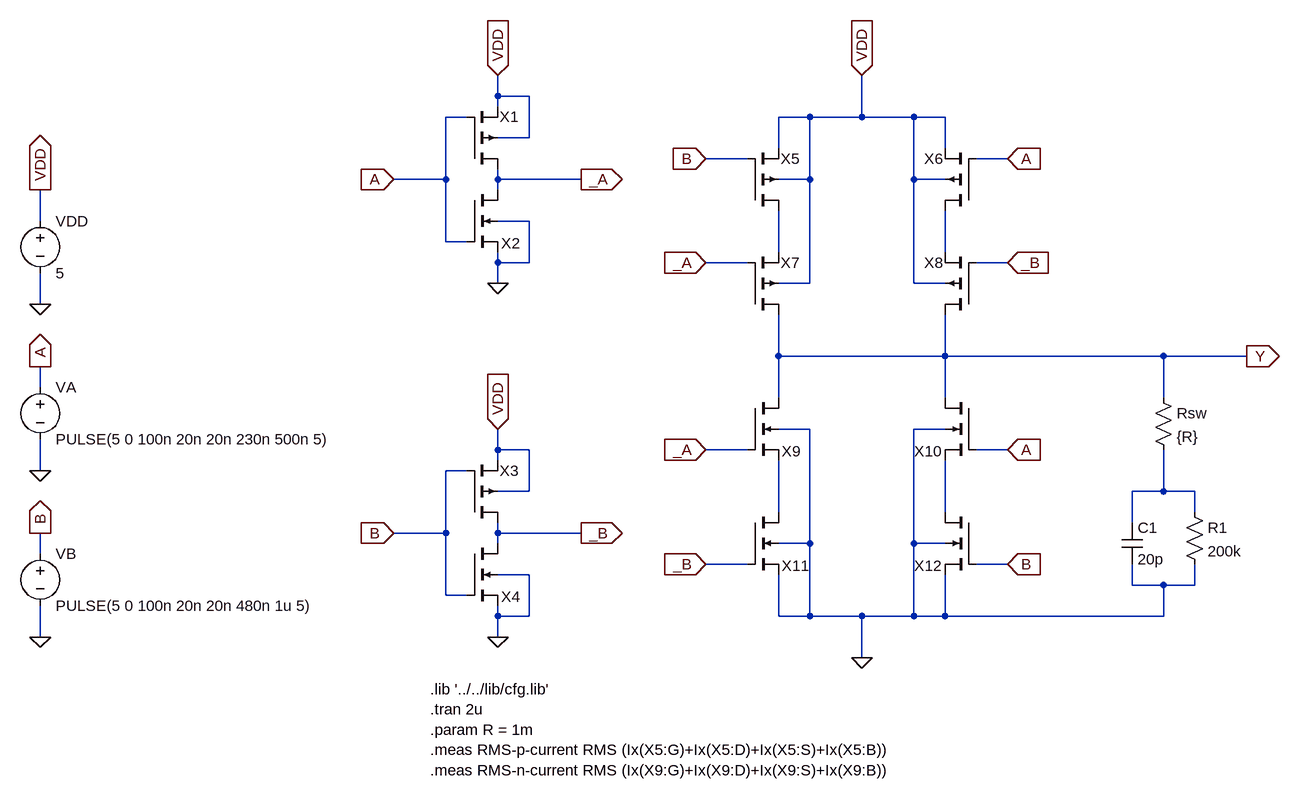
[diagram p0: schematic xor[pulse].asc]
xor[pulse].asc, the LTspice schematic file:
Version 4
SHEET 1 1564 904
WIRE 32 -384 32 -416
WIRE 80 -384 32 -384
WIRE 32 -368 32 -384
WIRE -16 -352 -48 -352
WIRE 512 -352 464 -352
WIRE 592 -352 592 -416
WIRE 592 -352 512 -352
WIRE 672 -352 592 -352
WIRE 720 -352 672 -352
WIRE 80 -320 80 -384
WIRE 80 -320 32 -320
WIRE 464 -304 464 -352
WIRE 720 -304 720 -352
WIRE 416 -288 352 -288
WIRE 816 -288 768 -288
WIRE -48 -256 -48 -352
WIRE -48 -256 -128 -256
WIRE 32 -256 32 -272
WIRE 160 -256 32 -256
WIRE 512 -256 512 -352
WIRE 512 -256 464 -256
WIRE 672 -256 672 -352
WIRE 720 -256 672 -256
WIRE 32 -240 32 -256
WIRE -672 -192 -672 -240
WIRE 80 -192 32 -192
WIRE -48 -160 -48 -256
WIRE -16 -160 -48 -160
WIRE 464 -144 464 -208
WIRE 720 -144 720 -208
WIRE 32 -128 32 -144
WIRE 80 -128 80 -192
WIRE 80 -128 32 -128
WIRE 416 -128 352 -128
WIRE 816 -128 768 -128
WIRE 32 -96 32 -128
WIRE 512 -96 512 -256
WIRE 512 -96 464 -96
WIRE 672 -96 672 -256
WIRE 720 -96 672 -96
WIRE -672 -64 -672 -112
WIRE 464 16 464 -48
WIRE 720 16 720 -48
WIRE 720 16 464 16
WIRE 1056 16 720 16
WIRE 1184 16 1056 16
WIRE -672 64 -672 32
WIRE 464 80 464 16
WIRE 720 80 720 16
WIRE 1056 80 1056 16
WIRE 512 128 464 128
WIRE 720 128 672 128
WIRE 32 160 32 128
WIRE 80 160 32 160
WIRE 416 160 352 160
WIRE 816 160 768 160
WIRE 32 176 32 160
WIRE -672 192 -672 144
WIRE -16 192 -48 192
WIRE 80 224 80 160
WIRE 80 224 32 224
WIRE 1056 224 1056 160
WIRE 1056 224 1008 224
WIRE 1104 224 1056 224
WIRE 464 256 464 176
WIRE 720 256 720 176
WIRE 1104 256 1104 224
WIRE 1008 272 1008 224
WIRE -48 288 -48 192
WIRE -48 288 -128 288
WIRE 32 288 32 272
WIRE 160 288 32 288
WIRE 32 304 32 288
WIRE 512 304 512 128
WIRE 512 304 464 304
WIRE 672 304 672 128
WIRE 720 304 672 304
WIRE -672 320 -672 288
WIRE 416 336 352 336
WIRE 816 336 768 336
WIRE 80 352 32 352
WIRE 1008 368 1008 336
WIRE 1056 368 1008 368
WIRE 1104 368 1104 336
WIRE 1104 368 1056 368
WIRE -48 384 -48 288
WIRE -16 384 -48 384
WIRE 32 416 32 400
WIRE 80 416 80 352
WIRE 80 416 32 416
WIRE 464 416 464 352
WIRE 512 416 512 304
WIRE 512 416 464 416
WIRE 592 416 512 416
WIRE 672 416 672 304
WIRE 672 416 592 416
WIRE 720 416 720 352
WIRE 720 416 672 416
WIRE 1056 416 1056 368
WIRE 1056 416 720 416
WIRE -672 448 -672 400
WIRE 32 448 32 416
WIRE 592 480 592 416
FLAG 592 480 0
FLAG -672 -64 0
FLAG 1184 16 Y
IOPIN 1184 16 Out
FLAG -672 -240 VDD
IOPIN -672 -240 Out
FLAG 592 -416 VDD
IOPIN 592 -416 In
FLAG -672 288 B
IOPIN -672 288 Out
FLAG -672 448 0
FLAG -672 32 A
IOPIN -672 32 Out
FLAG -672 192 0
FLAG -128 -256 A
IOPIN -128 -256 In
FLAG -128 288 B
IOPIN -128 288 In
FLAG 32 448 0
FLAG 160 288 _B
IOPIN 160 288 Out
FLAG 32 128 VDD
IOPIN 32 128 In
FLAG 32 -96 0
FLAG 160 -256 _A
IOPIN 160 -256 Out
FLAG 32 -416 VDD
IOPIN 32 -416 In
FLAG 352 -288 B
IOPIN 352 -288 In
FLAG 352 -128 _A
IOPIN 352 -128 In
FLAG 352 160 _A
IOPIN 352 160 In
FLAG 352 336 _B
IOPIN 352 336 In
FLAG 816 336 B
IOPIN 816 336 In
FLAG 816 160 A
IOPIN 816 160 In
FLAG 816 -128 _B
IOPIN 816 -128 In
FLAG 816 -288 A
IOPIN 816 -288 In
SYMBOL voltage -672 -208 R0
WINDOW 123 0 0 Left 2
WINDOW 39 0 0 Left 2
SYMATTR InstName VDD
SYMATTR Value 5
SYMBOL voltage -672 304 R0
WINDOW 123 0 0 Left 2
WINDOW 39 0 0 Left 2
SYMATTR InstName VB
SYMATTR Value PULSE(5 0 100n 20n 20n 480n 1u 5)
SYMBOL cap 992 272 R0
SYMATTR InstName C1
SYMATTR Value 20p
SYMBOL res 1088 240 R0
SYMATTR InstName R1
SYMATTR Value 200k
SYMBOL voltage -672 48 R0
WINDOW 123 0 0 Left 2
WINDOW 39 0 0 Left 2
SYMATTR InstName VA
SYMATTR Value PULSE(5 0 100n 20n 20n 230n 500n 5)
SYMBOL pmos4 -16 -272 M180
WINDOW 0 51 80 Left 2
WINDOW 3 52 23 Invisible 2
SYMATTR InstName X1
SYMATTR Value pmos_t1
SYMATTR Prefix X
SYMBOL res 1040 64 R0
SYMATTR InstName Rsw
SYMATTR Value {R}
SYMBOL nmos4 -16 -240 R0
WINDOW 0 53 82 Left 2
WINDOW 3 53 23 Invisible 2
SYMATTR InstName X2
SYMATTR Value nmos_t1
SYMATTR Prefix X
SYMBOL pmos4 -16 272 M180
WINDOW 0 51 80 Left 2
WINDOW 3 52 23 Invisible 2
SYMATTR InstName X3
SYMATTR Value pmos_t1
SYMATTR Prefix X
SYMBOL nmos4 -16 304 R0
WINDOW 0 53 82 Left 2
WINDOW 3 53 23 Invisible 2
SYMATTR InstName X4
SYMATTR Value nmos_t1
SYMATTR Prefix X
SYMBOL pmos4 416 -208 M180
WINDOW 0 51 80 Left 2
WINDOW 3 52 23 Invisible 2
SYMATTR InstName X5
SYMATTR Value pmos_t1
SYMATTR Prefix X
SYMBOL pmos4 768 -208 R180
WINDOW 0 51 80 Left 2
WINDOW 3 52 23 Invisible 2
SYMATTR InstName X6
SYMATTR Value pmos_t1
SYMATTR Prefix X
SYMBOL pmos4 416 -48 M180
WINDOW 0 51 80 Left 2
WINDOW 3 52 23 Invisible 2
SYMATTR InstName X7
SYMATTR Value pmos_t1
SYMATTR Prefix X
SYMBOL pmos4 768 -48 R180
WINDOW 0 51 80 Left 2
WINDOW 3 52 23 Invisible 2
SYMATTR InstName X8
SYMATTR Value pmos_t1
SYMATTR Prefix X
SYMBOL nmos4 416 80 R0
WINDOW 0 53 82 Left 2
WINDOW 3 53 23 Invisible 2
SYMATTR InstName X9
SYMATTR Value nmos_t1
SYMATTR Prefix X
SYMBOL nmos4 768 80 M0
WINDOW 0 53 82 Left 2
WINDOW 3 53 23 Invisible 2
SYMATTR InstName X10
SYMATTR Value nmos_t1
SYMATTR Prefix X
SYMBOL nmos4 416 256 R0
WINDOW 0 53 82 Left 2
WINDOW 3 53 23 Invisible 2
SYMATTR InstName X11
SYMATTR Value nmos_t1
SYMATTR Prefix X
SYMBOL nmos4 768 256 M0
WINDOW 0 53 82 Left 2
WINDOW 3 53 23 Invisible 2
SYMATTR InstName X12
SYMATTR Value nmos_t1
SYMATTR Prefix X
TEXT -72 528 Left 2 !.lib '../../lib/cfg.lib'\n.tran 2u\n.param R = 1m\n.meas RMS-p-current RMS (Ix(X5:G)+Ix(X5:D)+Ix(X5:S)+Ix(X5:B))\n.meas RMS-n-current RMS (Ix(X9:G)+Ix(X9:D)+Ix(X9:S)+Ix(X9:B))

The netlist it stands for:
* xor[pulse].asc
VDD VDD 0 5
VB B 0 PULSE(5 0 100n 20n 20n 480n 1u 5)
C1 N003 0 20p
R1 N003 0 200k
VA A 0 PULSE(5 0 100n 20n 20n 230n 500n 5)
XX1 _A A VDD VDD pmos_t1  ; pins D G S B
Rsw Y N003 {R}
XX2 _A A 0 0 nmos_t1  ; pins D G S B
XX3 _B B VDD VDD pmos_t1  ; pins D G S B
XX4 _B B 0 0 nmos_t1  ; pins D G S B
XX5 N001 B VDD VDD pmos_t1  ; pins D G S B
XX6 N002 A VDD VDD pmos_t1  ; pins D G S B
XX7 Y _A N001 VDD pmos_t1  ; pins D G S B
XX8 Y _B N002 VDD pmos_t1  ; pins D G S B
XX9 Y _A N004 0 nmos_t1  ; pins D G S B
XX10 Y A N005 0 nmos_t1  ; pins D G S B
XX11 N004 _B 0 0 nmos_t1  ; pins D G S B
XX12 N005 B 0 0 nmos_t1  ; pins D G S B
.lib '../../lib/cfg.lib'
.tran 2u
.param R = 1m
.meas RMS-p-current RMS (Ix(X5:G)+Ix(X5:D)+Ix(X5:S)+Ix(X5:B))
.meas RMS-n-current RMS (Ix(X9:G)+Ix(X9:D)+Ix(X9:S)+Ix(X9:B))
.backanno
.end